# Altium schematic sheet [3]-RK3399_EMMC_ADC_PCIE.SchDoc: RK3399 SOM Board Design V1.0
size A4; Author: AVIRAL MISHRA; DocumentNumber: 5; SheetNumber: 5; SheetTotal: 21; PROJECT CODE: A_V1.0
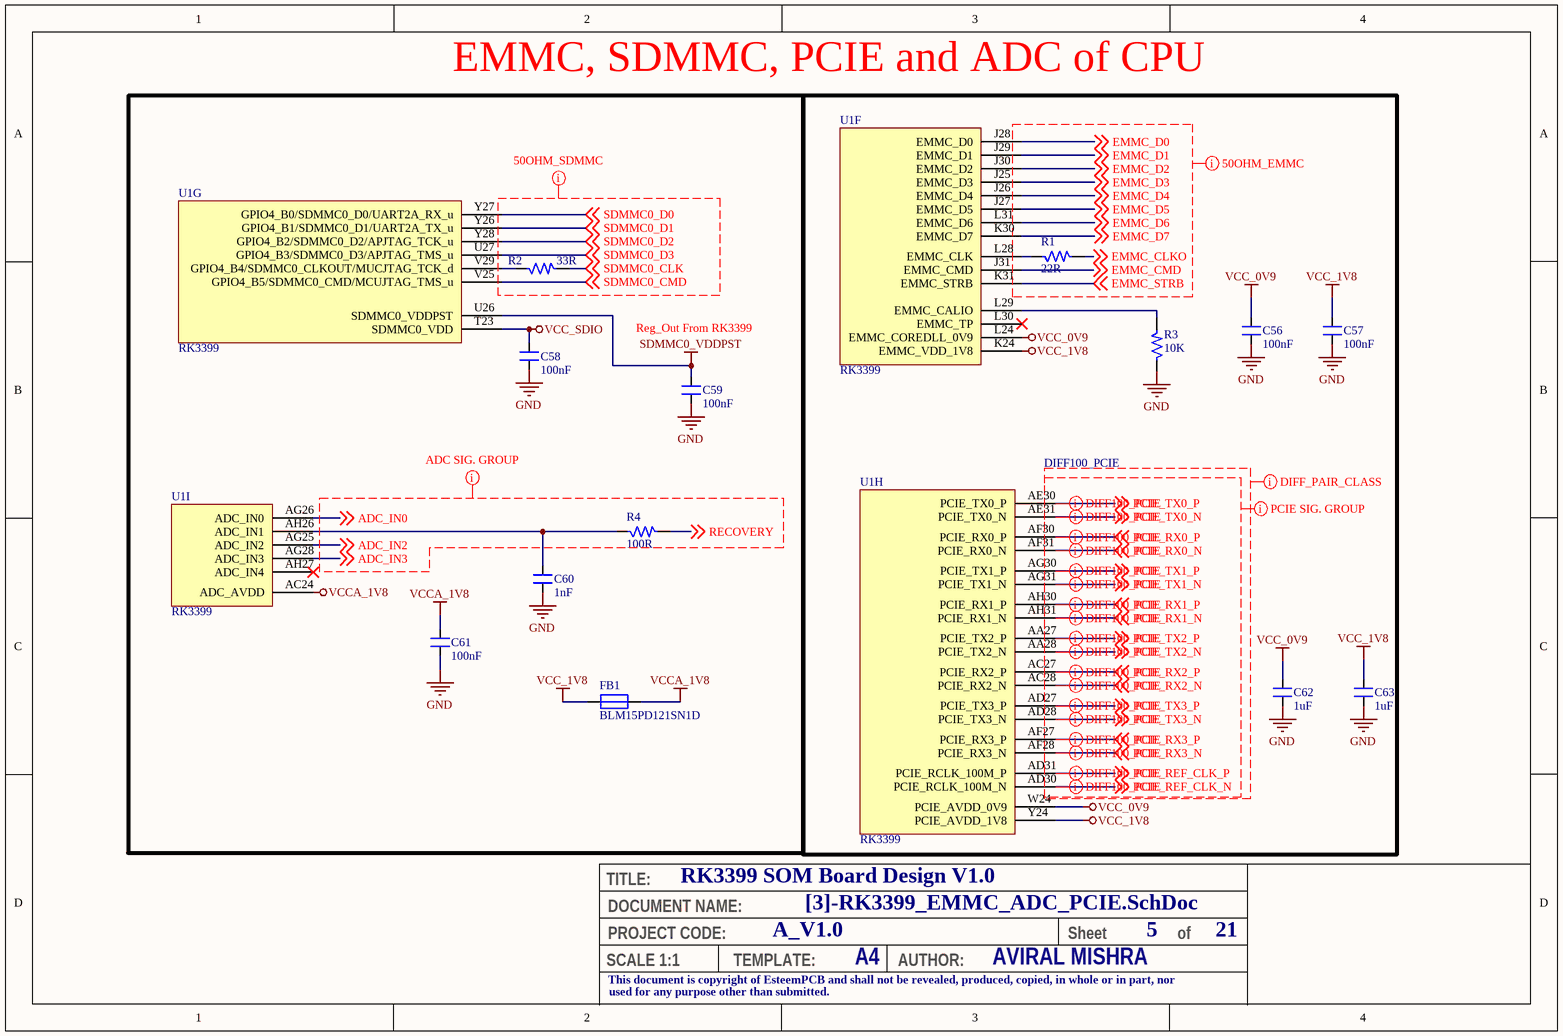
[diagram p0: [3]-RK3399_EMMC_ADC_PCIE.SchDoc]

## Parts
C56  100nF  [CAP_0201]
C57  100nF  [CAP_0201]
C58  100nF  [CAP_0201]
C59  100nF  [CAP_0201]
C60  1nF  [CAP_0201]
C61  100nF  [CAP_0201]
C62  1uF  [CAP_0201]
C63  1uF  [CAP_0201]
FB1  BLM15PD121SN1D  [RES_0402]
R1  22R  [RES_0201]
R2  33R  [RES_0201]
R3  10K  [RES_0201]
R4  100R  [RES_0201]
U1  RK3399  [FBGA828_23_826X826]  (parts F,G,H,I of 24)

## Blocks framed on the sheet
EMMC, SDMMC, PCIE and ADC of CPU: C58-C61 FB1 R2 R4 U1

## Nets
GND: C56.1 C57.1 C58.1 C59.1 C60.1 C61.1 C62.1 C63.1 R3.1
SDMMC0_VDDPST: C59.2 U1.U26(SDMMC0_VDDPST)
VCC_0V9: C56.2 C62.2 U1.L24(EMMC_COREDLL_0V9) U1.W24(PCIE_AVDD_0V9)
VCC_1V8: C57.2 C63.2 FB1.1 U1.K24(EMMC_VDD_1V8) U1.Y24(PCIE_AVDD_1V8)
VCC_SDIO: C58.2 U1.T23(SDMMC0_VDD)
VCCA_1V8: C61.2 FB1.2 U1.AC24(ADC_AVDD)
ADC_IN0: U1.AG26(ADC_IN0) ; off-sheet ADC_IN0
ADC_IN2: U1.AG25(ADC_IN2) ; off-sheet ADC_IN2
ADC_IN3: U1.AG28(ADC_IN3) ; off-sheet ADC_IN3
EMMC_CLKO: R1.2 ; off-sheet EMMC_CLKO
EMMC_CMD: U1.J31(EMMC_CMD) ; off-sheet EMMC_CMD
EMMC_D0: U1.J28(EMMC_D0) ; off-sheet EMMC_D0
EMMC_D1: U1.J29(EMMC_D1) ; off-sheet EMMC_D1
EMMC_D2: U1.J30(EMMC_D2) ; off-sheet EMMC_D2
EMMC_D3: U1.J25(EMMC_D3) ; off-sheet EMMC_D3
EMMC_D4: U1.J26(EMMC_D4) ; off-sheet EMMC_D4
EMMC_D5: U1.J27(EMMC_D5) ; off-sheet EMMC_D5
EMMC_D6: U1.L31(EMMC_D6) ; off-sheet EMMC_D6
EMMC_D7: U1.K30(EMMC_D7) ; off-sheet EMMC_D7
EMMC_STRB: U1.K31(EMMC_STRB) ; off-sheet EMMC_STRB
PCIE_REF_CLK_N: U1.AD30(PCIE_RCLK_100M_N) ; off-sheet PCIE_REF_CLK_N
PCIE_REF_CLK_P: U1.AD31(PCIE_RCLK_100M_P) ; off-sheet PCIE_REF_CLK_P
PCIE_RX0_N: U1.AF31(PCIE_RX0_N) ; off-sheet PCIE_RX0_N
PCIE_RX0_P: U1.AF30(PCIE_RX0_P) ; off-sheet PCIE_RX0_P
PCIE_RX1_N: U1.AH31(PCIE_RX1_N) ; off-sheet PCIE_RX1_N
PCIE_RX1_P: U1.AH30(PCIE_RX1_P) ; off-sheet PCIE_RX1_P
PCIE_RX2_N: U1.AC28(PCIE_RX2_N) ; off-sheet PCIE_RX2_N
PCIE_RX2_P: U1.AC27(PCIE_RX2_P) ; off-sheet PCIE_RX2_P
PCIE_RX3_N: U1.AF28(PCIE_RX3_N) ; off-sheet PCIE_RX3_N
PCIE_RX3_P: U1.AF27(PCIE_RX3_P) ; off-sheet PCIE_RX3_P
PCIE_TX0_N: U1.AE31(PCIE_TX0_N) ; off-sheet PCIE_TX0_N
PCIE_TX0_P: U1.AE30(PCIE_TX0_P) ; off-sheet PCIE_TX0_P
PCIE_TX1_N: U1.AG31(PCIE_TX1_N) ; off-sheet PCIE_TX1_N
PCIE_TX1_P: U1.AG30(PCIE_TX1_P) ; off-sheet PCIE_TX1_P
PCIE_TX2_N: U1.AA28(PCIE_TX2_N) ; off-sheet PCIE_TX2_N
PCIE_TX2_P: U1.AA27(PCIE_TX2_P) ; off-sheet PCIE_TX2_P
PCIE_TX3_N: U1.AD28(PCIE_TX3_N) ; off-sheet PCIE_TX3_N
PCIE_TX3_P: U1.AD27(PCIE_TX3_P) ; off-sheet PCIE_TX3_P
RECOVERY: R4.2 ; off-sheet RECOVERY
SDMMC0_CLK: R2.2 ; off-sheet SDMMC0_CLK
SDMMC0_CMD: U1.V25(GPIO4_B5/SDMMC0_CMD/MCUJTAG_TMS_u) ; off-sheet SDMMC0_CMD
SDMMC0_D0: U1.Y27(GPIO4_B0/SDMMC0_D0/UART2A_RX_u) ; off-sheet SDMMC0_D0
SDMMC0_D1: U1.Y26(GPIO4_B1/SDMMC0_D1/UART2A_TX_u) ; off-sheet SDMMC0_D1
SDMMC0_D2: U1.Y28(GPIO4_B2/SDMMC0_D2/APJTAG_TCK_u) ; off-sheet SDMMC0_D2
SDMMC0_D3: U1.U27(GPIO4_B3/SDMMC0_D3/APJTAG_TMS_u) ; off-sheet SDMMC0_D3
NetC60_2: C60.2 R4.1 U1.AH26(ADC_IN1)
NetR1_1: R1.1 U1.L28(EMMC_CLK)
NetR2_1: R2.1 U1.V29(GPIO4_B4/SDMMC0_CLKOUT/MUCJTAG_TCK_d)
NetR3_2: R3.2 U1.L29(EMMC_CALIO)

Not connected (* = marked no-connect by the designer): U1 AH27(ADC_IN4)* L30(EMMC_TP)*

## Layout directives
net class 50OHM_SDMMC: SDMMC0_CLK, SDMMC0_CMD, SDMMC0_D0, SDMMC0_D1, SDMMC0_D2, SDMMC0_D3
net class 50OHM_EMMC: EMMC_CLKO, EMMC_CMD, EMMC_D0, EMMC_D1, EMMC_D2, EMMC_D3, EMMC_D4, EMMC_D5, EMMC_D6, EMMC_D7, EMMC_STRB
net class PCIE SIG. GROUP: PCIE_REF_CLK_N, PCIE_REF_CLK_P, PCIE_RX0_N, PCIE_RX0_P, PCIE_RX1_N, PCIE_RX1_P, PCIE_RX2_N, PCIE_RX2_P, PCIE_RX3_N, PCIE_RX3_P, PCIE_TX0_N, PCIE_TX0_P, PCIE_TX1_N, PCIE_TX1_P, PCIE_TX2_N, PCIE_TX2_P, PCIE_TX3_N, PCIE_TX3_P
net class ADC SIG. GROUP: ADC_IN0, ADC_IN2, ADC_IN3, RECOVERY
differential pair; differential pair class DIFF100_PCIE: PCIE_REF_CLK_N, PCIE_REF_CLK_P, PCIE_RX0_N, PCIE_RX0_P, PCIE_RX1_N, PCIE_RX1_P, PCIE_RX2_N, PCIE_RX2_P, PCIE_RX3_N, PCIE_RX3_P, PCIE_TX0_N, PCIE_TX0_P, PCIE_TX1_N, PCIE_TX1_P, PCIE_TX2_N, PCIE_TX2_P, PCIE_TX3_N, PCIE_TX3_P
net class DIFF_PAIR_CLASS: PCIE_REF_CLK_N, PCIE_REF_CLK_P, PCIE_RX0_N, PCIE_RX0_P, PCIE_RX1_N, PCIE_RX1_P, PCIE_RX2_N, PCIE_RX2_P, PCIE_RX3_N, PCIE_RX3_P, PCIE_TX0_N, PCIE_TX0_P, PCIE_TX1_N, PCIE_TX1_P, PCIE_TX2_N, PCIE_TX2_P, PCIE_TX3_N, PCIE_TX3_P

## Notes on the sheet
- (near C59) Reg_Out From RK3399
- TITLE:
- DOCUMENT NAME:
- SCALE 1:1
- This document is copyright of EsteemPCB and shall not be revealed, produced, copied, in whole or in part, nor
- PROJECT CODE:
- TEMPLATE:
- A4
- AUTHOR:
- Sheet
- of
- used for any purpose other than submitted.

## Library data of the parts
C56-C59 C61 = CAP_100nF-25V-10%-0201: 0.1µF ±10% 25V Ceramic Capacitor X5R 0201 (0603 Metric) /; Manufacturer: TDK Corporation; Manufacturer Part Number: C0603X5R1E104K030BB; Case/Package: 0201; Supplier-1: Digikey
C60 = CAP_1nF-16V-10%-0201: 1000pF ±10% 16V Ceramic Capacitor X7R 0201 (0603 Metric) /; Manufacturer: Murata Electronics; Manufacturer Part Number: GRM033R71C102KA01D; Case/Package: 0201; Supplier-1: Digikey
C62 C63 = CAP_1uF-16V-10%-0201: 1µF ±20% 16V Ceramic Capacitor X5R 0201 (0603 Metric) /; Manufacturer: Samsung Electro-Mechanics; Manufacturer Part Number: CL03A105MO3NRNH; Case/Package: 0201; Supplier-1: Digikey
FB1 = FB_120R-1.3A-100Mhz-0402: 120 Ohms @ 100MHz 1 Power Line Ferrite Bead 0402 (1005 Metric) 1.3A 90mOhm; Manufacturer: Murata Electronics; Mnaufacturer Part Number: BLM15PD121SN1D; Case/Package: 0402; Supplier-1: Digikey
R1 = RES_22R-0.05W-1%-0201: 22 Ohms ±1% 0.05W, 1/20W Chip Resistor 0201 (0603 Metric) Moisture Resistant Thick Film /; Manufacturer: Yageo; Manufacturer Part Number: RC0201FR-0722RL; Case/Package: 0201; Supplier-1: Digikey
R2 = RES_33R-0.05W-1%-0201: 33 Ohms ±1% 0.05W, 1/20W Chip Resistor 0201 (0603 Metric) Thick Film /; Manufacturer: Yageo; Manufacturer Part Number: RC0201FR-0733RL; Case/Package: 0201; Supplier-1: Digikey
R3 = RES_10K-0.05W-1%-0201: 10 kOhms ±1% 0.05W, 1/20W Chip Resistor 0201 (0603 Metric) Thick Film /; Manufacturer: Stackpole Electronics Inc; Manufacturer Part Number: RMCF0201FT10K0; Case/Package: 0201; Supplier-1: Digikey
R4 = RES_100R-0.05W-1%-0201: 100 kOhms ±1% 0.05W, 1/20W Chip Resistor 0201 (0603 Metric) Automotive AEC-Q200 Thick Film /; Manufacturer: Panasonic Electronic Components; Manufacturer Part Number: ERJ-1GNF1003C; Case/Package: 0201; Supplier-1: Digikey
U1 = IC_RK3399-FCBGA828: RK3399 is a low power, high performance processor for computing, personal mobile.; Manufacturer: Rockchip; Manufacturer Part Number: RK3399; Case/Package: FCBGA828; Supplier-1: Rockchip